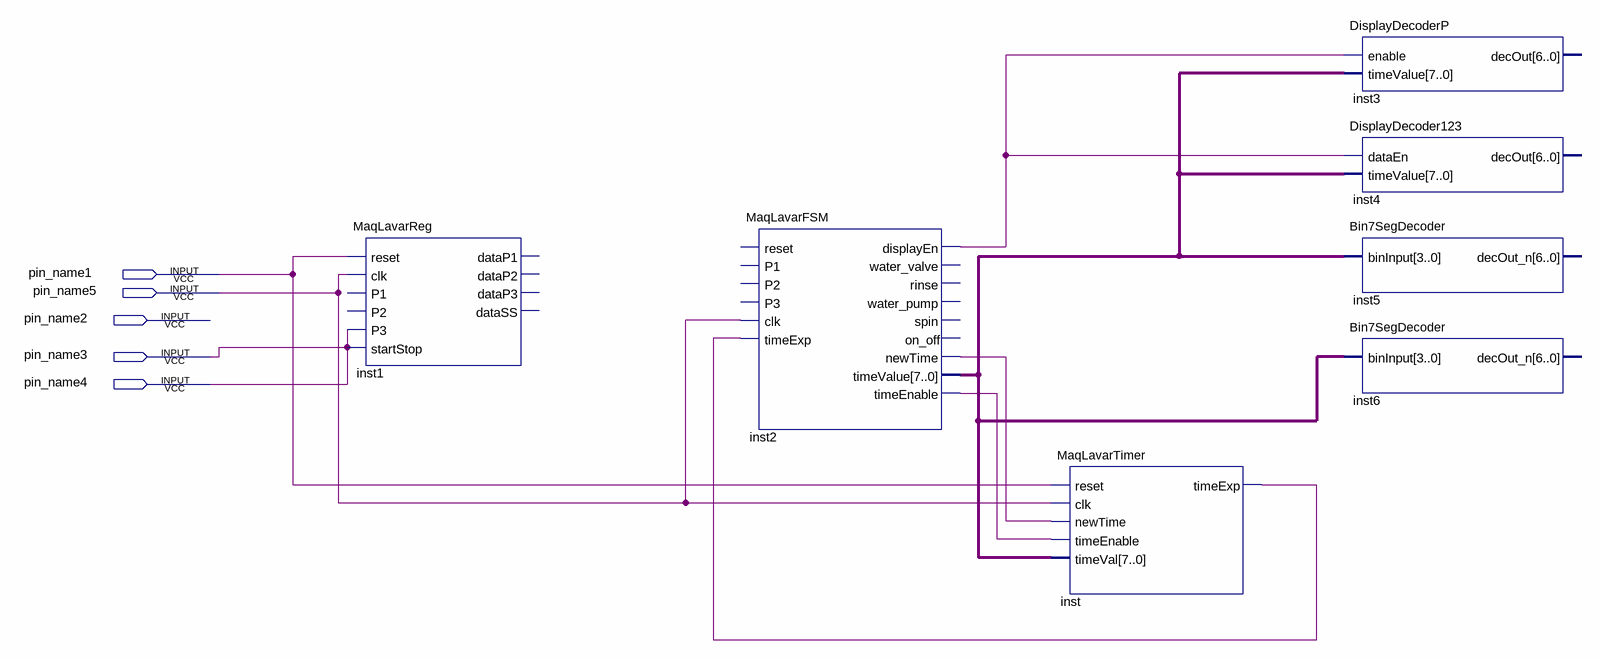
[diagram p0: schematic sheet]
// Quartus schematic MaqLavarTest.bdf as structural Verilog: 7 symbols, 5 pins
module MaqLavarTest (
  input  pin_name1,
  input  pin_name5,
  input  pin_name2,
  input  pin_name3,
  input  pin_name4
);

  wire inst2_displayen, inst2_newtime, inst2_timeenable, inst_timeexp;
  wire [7:0] inst2_timevalue;

  MaqLavarReg inst1 (
    .reset(pin_name1), .clk(pin_name5), .P3(pin_name3), .startStop(pin_name3));  // open: P1, P2, dataP1, dataP2, dataP3, dataSS
  MaqLavarFSM inst2 (
    .clk(pin_name5), .timeExp(inst_timeexp), .displayEn(inst2_displayen), .newTime(inst2_newtime),
    .timeValue(inst2_timevalue), .timeEnable(inst2_timeenable));  // open: reset, P1, P2, P3, water_valve, rinse, water_pump, spin, on_off
  MaqLavarTimer inst (
    .reset(pin_name1), .clk(pin_name5), .newTime(inst2_newtime), .timeEnable(inst2_timeenable),
    .timeVal(inst2_timevalue), .timeExp(inst_timeexp));
  DisplayDecoderP inst3 (.enable(inst2_displayen), .timeValue(inst2_timevalue));  // open: decOut
  DisplayDecoder123 inst4 (.dataEn(inst2_displayen), .timeValue(inst2_timevalue));  // open: decOut
  Bin7SegDecoder inst5 (.binInput(inst2_timevalue));  // open: decOut_n
  Bin7SegDecoder inst6 (.binInput(inst2_timevalue));  // open: decOut_n

  assign pin_name4 = pin_name3;
endmodule
